# EAGLE design CON_REVC (EAGLE 9.6.2)

## Sheet 1 of 2: Template
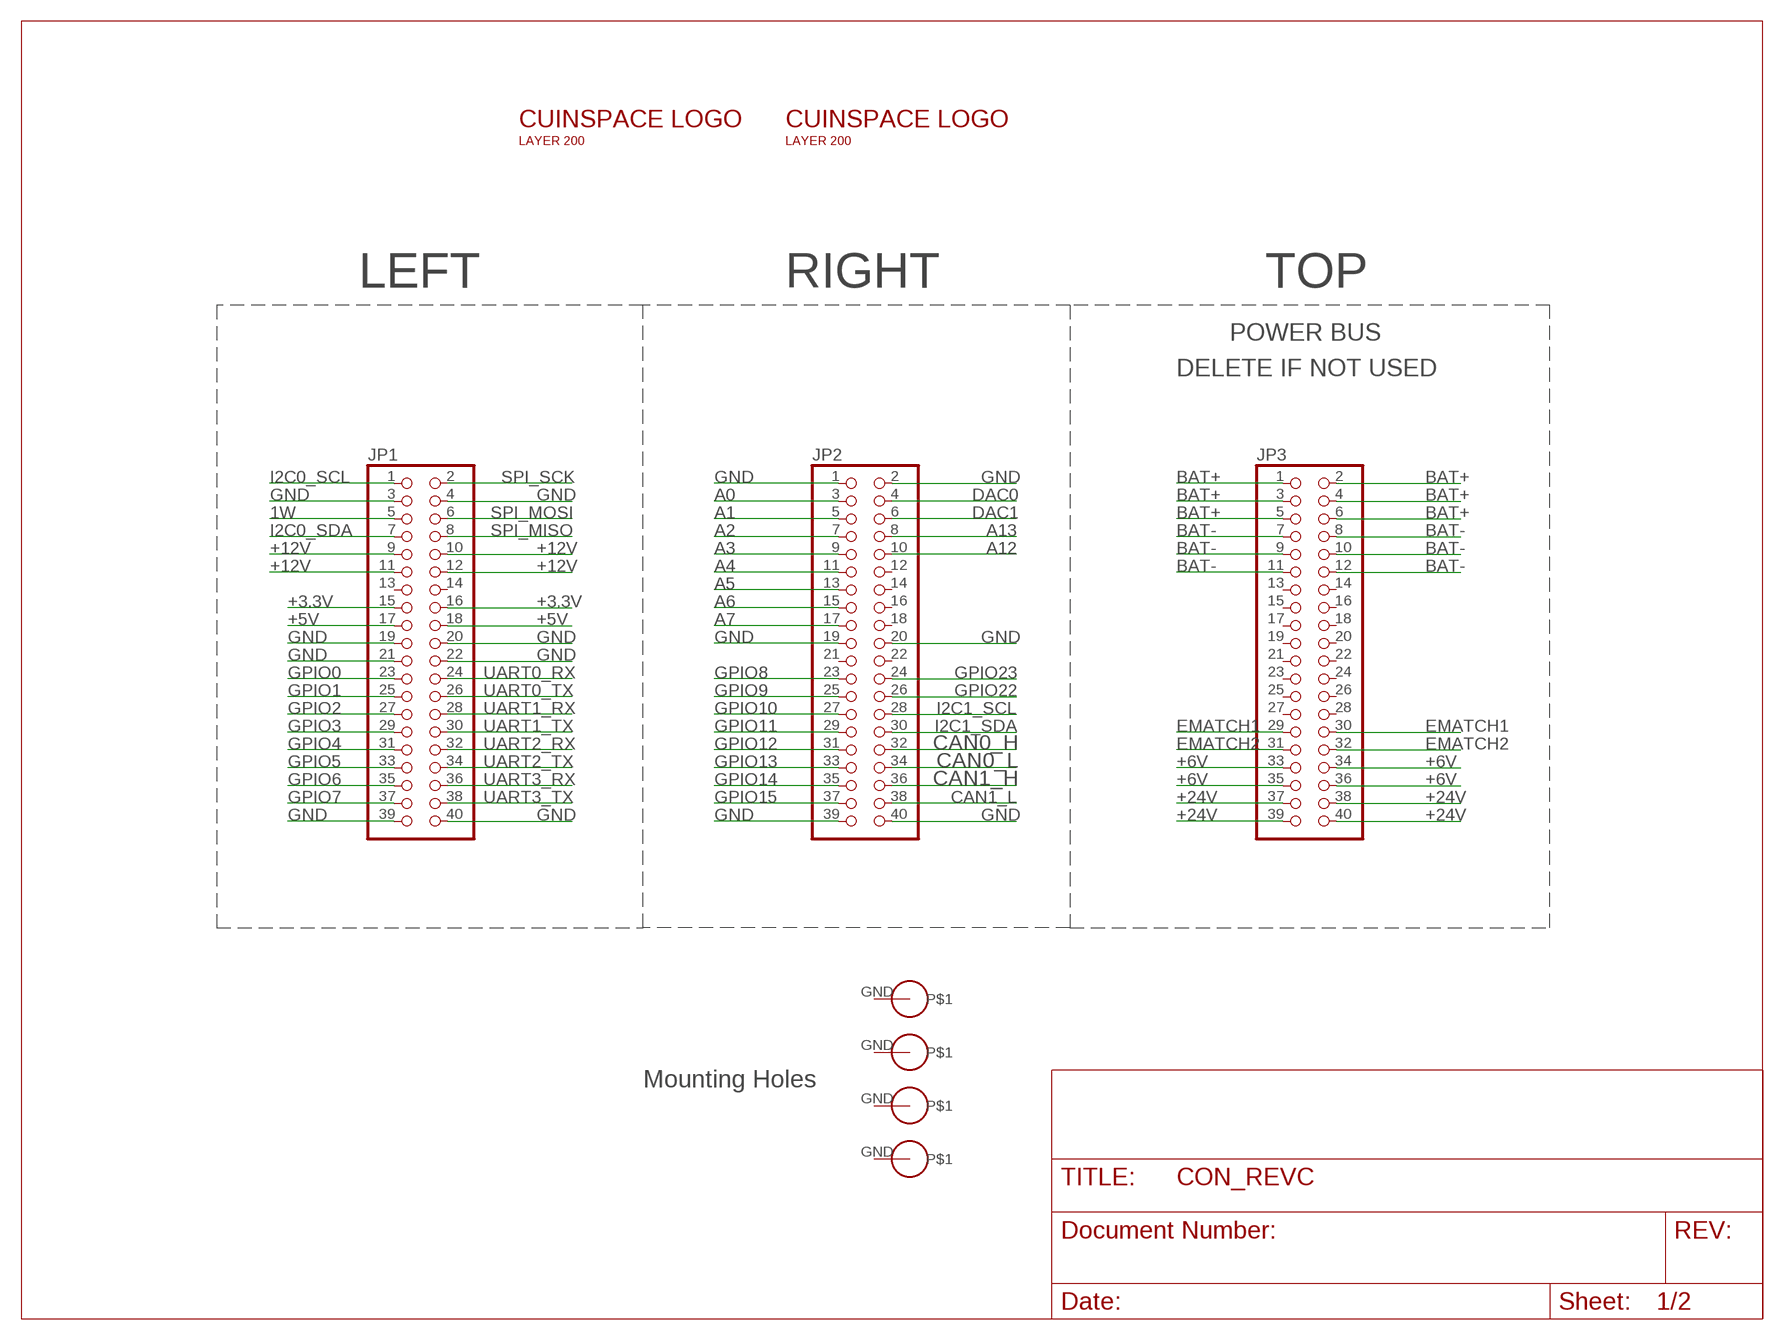
[diagram p0: schematic, sheet 1]

### Parts
$$U$1  PS/104-MOUNTING-HOLE  [PC/104-MOUNTING-HOLE]
JP1  PINHD-2X20  [2X20]
JP2  PINHD-2X20  [2X20]
JP3  PINHD-2X20  [2X20]
U$1  PS/104-MOUNTING-HOLE  [PC/104-MOUNTING-HOLE]
U$2  PS/104-MOUNTING-HOLE  [PC/104-MOUNTING-HOLE]
U$3  PS/104-MOUNTING-HOLE  [PC/104-MOUNTING-HOLE]
U$5  INSPACE3CM_L  [INSPACE_3CM_LETTERS]
U$6  INSPACE3CM_L  [INSPACE_3CM_LETTERS]

### Nets
1W: JP1.5
+3.3V: JP1.15 JP1.16
+5V: JP1.17 JP1.18 ; also sheet 2
+6V: JP3.33 JP3.34 JP3.35 JP3.36
+12V: JP1.9 JP1.10 JP1.11 JP1.12
+24V: JP3.37 JP3.38 JP3.39 JP3.40
A0: JP2.3
A1: JP2.5
A2: JP2.7
A3: JP2.9
A4: JP2.11
A5: JP2.13
A6: JP2.15
A7: JP2.17
A12: JP2.10
A13: JP2.8
BAT+: JP3.1 JP3.2 JP3.3 JP3.4 JP3.5 JP3.6 ; also sheet 2
BAT-: JP3.7 JP3.8 JP3.9 JP3.10 JP3.11 JP3.12 ; also sheet 2
CAN0_H [diff pairs]: JP2.32
CAN0_L [diff pairs]: JP2.34
CAN1_H: JP2.36
CAN1_L: JP2.38
DAC0: JP2.4
DAC1: JP2.6
EMATCH1: JP3.29 JP3.30 ; also sheet 2
EMATCH2: JP3.31 JP3.32 ; also sheet 2
GND [New Class]: JP1.3 JP1.4 JP1.19 JP1.20 JP1.21 JP1.22 JP1.39 JP1.40 JP2.1 JP2.2 JP2.19 JP2.20 JP2.39 JP2.40 ; also sheet 2
GPIO0: JP1.23
GPIO1: JP1.25
GPIO2: JP1.27
GPIO3: JP1.29
GPIO4: JP1.31
GPIO5: JP1.33
GPIO6: JP1.35
GPIO7: JP1.37
GPIO8: JP2.23
GPIO9: JP2.25
GPIO10: JP2.27
GPIO11: JP2.29
GPIO12: JP2.31
GPIO13: JP2.33
GPIO14: JP2.35
GPIO15: JP2.37 ; also sheet 2
GPIO22: JP2.26
GPIO23: JP2.24
I2C0_SCL: JP1.1
I2C0_SDA: JP1.7
I2C1_SCL: JP2.28
I2C1_SDA: JP2.30
SPI_MISO: JP1.8
SPI_MOSI: JP1.6
SPI_SCK: JP1.2
UART0_RX: JP1.24
UART0_TX: JP1.26
UART1_RX: JP1.28
UART1_TX: JP1.30
UART2_RX: JP1.32
UART2_TX: JP1.34
UART3_RX: JP1.36
UART3_TX: JP1.38
Unconnected: $$U$1.GND JP1.13 JP1.14 JP2.12 JP2.14 JP2.16 JP2.18 JP2.21 JP2.22 JP3.13 JP3.14 JP3.15 JP3.16 JP3.17 JP3.18 JP3.19 JP3.20 JP3.21 JP3.22 JP3.23 JP3.24 JP3.25 JP3.26 JP3.27 JP3.28 U$1.GND U$2.GND U$3.GND

### Notes on the sheet
- LEFT | RIGHT | TOP
- POWER BUS
- DELETE IF NOT USED
- Mounting Holes

## Sheet 2 of 2
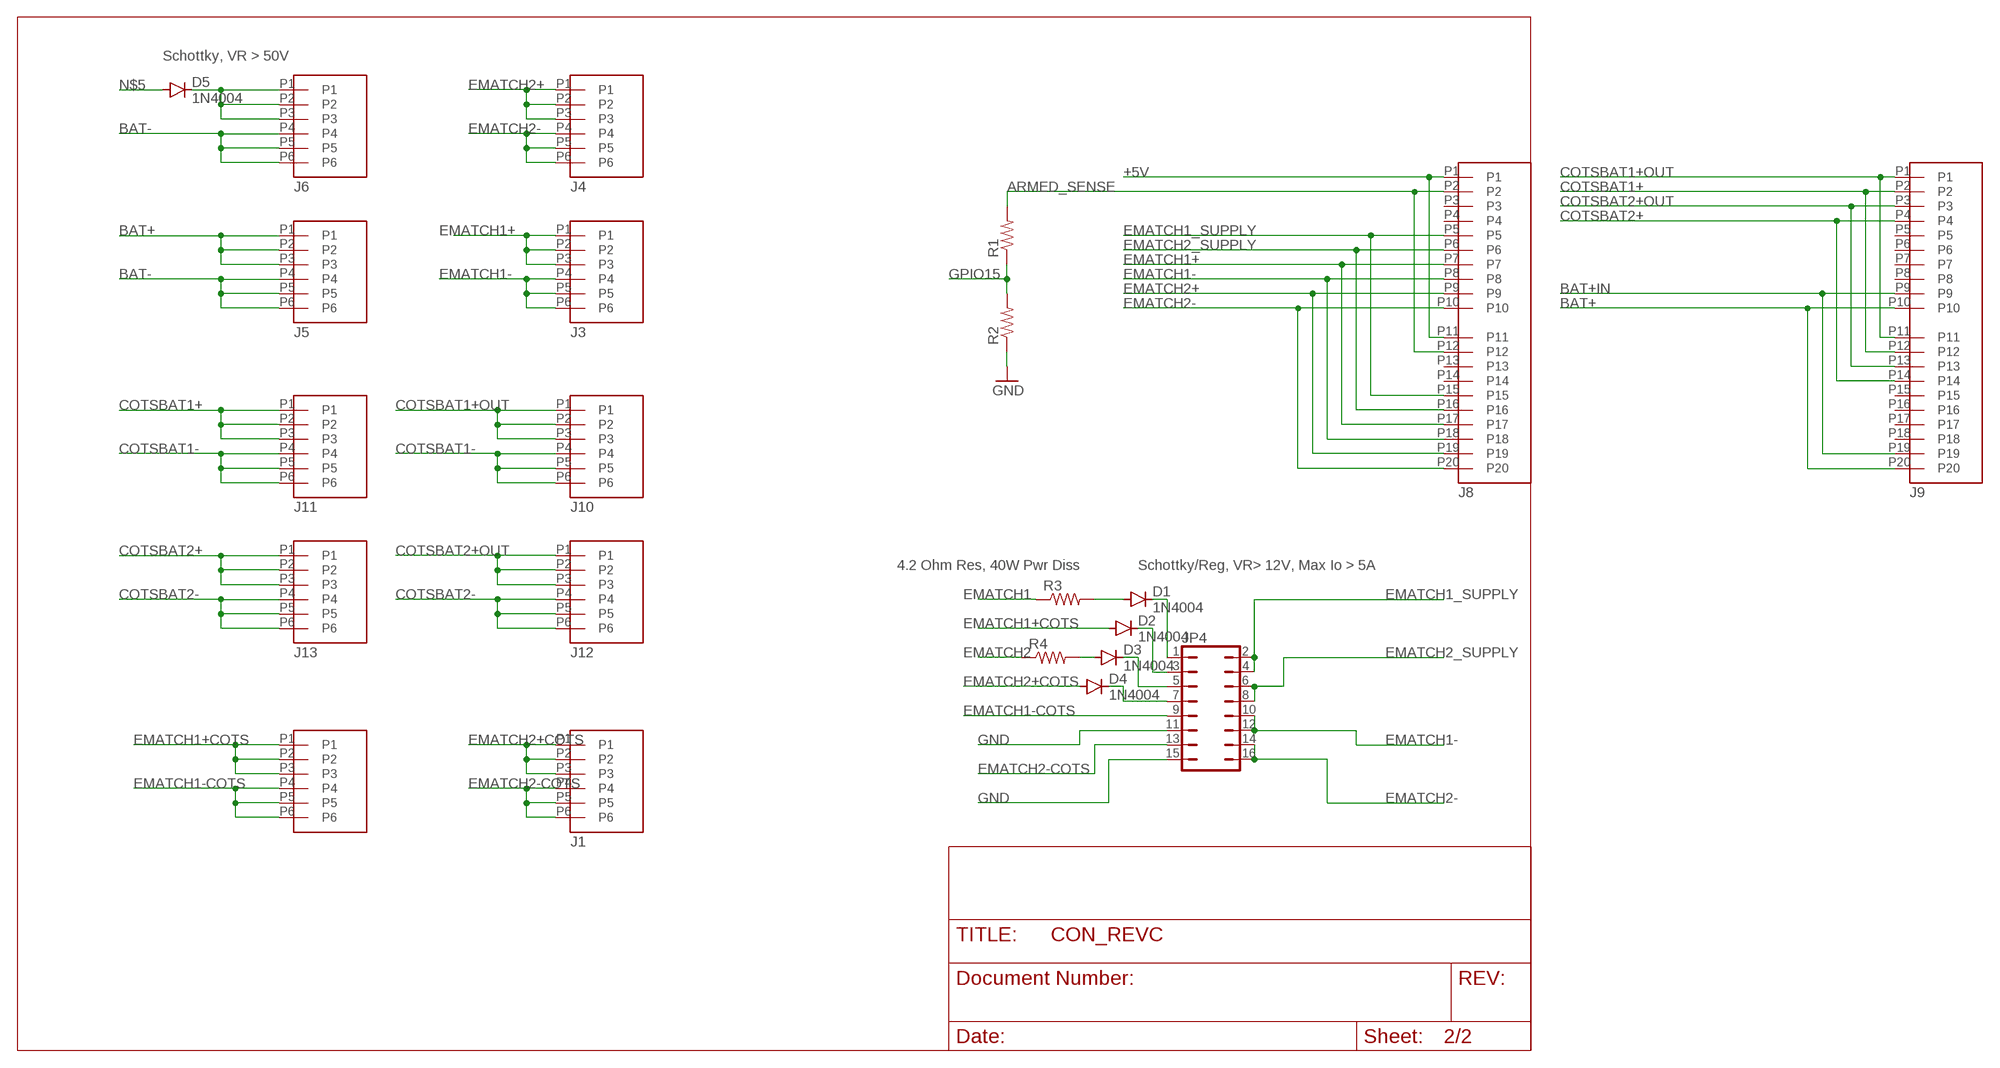
[diagram p1: schematic, sheet 2]

### Parts
D1  1N4004  [DO41-10]
D2  1N4004  [DO41-10]
D3  1N4004  [DO41-10]
D4  1N4004  [DO41-10]
D5  1N4004  [DO41-10]
J1  M80-5100642  [M80-5100642]
J2  M80-5100642  [M80-5100642]
J3  M80-5100642  [M80-5100642]
J4  M80-5100642  [M80-5100642]
J5  M80-5100642  [M80-5100642]
J6  M80-5100642  [M80-5100642]
J8  M80-5102042  [M80-5102042]
J9  M80-5102042  [M80-5102042]
J10  M80-5100642  [M80-5100642]
J11  M80-5100642  [M80-5100642]
J12  M80-5100642  [M80-5100642]
J13  M80-5100642  [M80-5100642]
JP4  JP8Q  [JP8Q]
R1  R-US_R0805  [R0805]
R2  R-US_R0805  [R0805]
R3  R-US_R0805  [R0805]
R4  R-US_R0805  [R0805]

### Nets
+5V: J8.P1 J8.P11 ; also sheet 1
ARMED_SENSE: J8.P2 J8.P12 R1.2
BAT+: J5.P1 J5.P2 J5.P3 J9.P10 J9.P20 ; also sheet 1
BAT+IN: D5.C J6.P1 J6.P2 J6.P3 J9.P9 J9.P19
BAT-: J5.P4 J5.P5 J5.P6 J6.P4 J6.P5 J6.P6 ; also sheet 1
COTSBAT1+: J9.P2 J9.P12 J11.P1 J11.P2 J11.P3
COTSBAT1+OUT: J9.P1 J9.P11 J10.P1 J10.P2 J10.P3
COTSBAT1-: J10.P4 J10.P5 J10.P6 J11.P4 J11.P5 J11.P6
COTSBAT2+: J9.P4 J9.P14 J13.P1 J13.P2 J13.P3
COTSBAT2+OUT: J9.P3 J9.P13 J12.P1 J12.P2 J12.P3
COTSBAT2-: J12.P4 J12.P5 J12.P6 J13.P4 J13.P5 J13.P6
EMATCH1: R3.1 ; also sheet 1
EMATCH1+: J3.P1 J3.P2 J3.P3 J8.P7 J8.P17
EMATCH1+COTS: D2.A J2.P1 J2.P2 J2.P3
EMATCH1-: J3.P4 J3.P5 J3.P6 J8.P8 J8.P18 JP4.10 JP4.12
EMATCH1-COTS: J2.P4 J2.P5 J2.P6 JP4.9
EMATCH1_SUPPLY: J8.P5 J8.P15 JP4.2 JP4.4
EMATCH2: R4.1 ; also sheet 1
EMATCH2+: J4.P1 J4.P2 J4.P3 J8.P9 J8.P19
EMATCH2+COTS: D4.A J1.P1 J1.P2 J1.P3
EMATCH2-: J4.P4 J4.P5 J4.P6 J8.P10 J8.P20 JP4.14 JP4.16
EMATCH2-COTS: J1.P4 J1.P5 J1.P6 JP4.13
EMATCH2_SUPPLY: J8.P6 J8.P16 JP4.6 JP4.8
GND [New Class]: JP4.11 JP4.15 R2.1 ; also sheet 1
GPIO15: R1.1 R2.2 ; also sheet 1
N$1: D1.C JP4.1
N$2: D2.C JP4.3
N$3: D3.C JP4.5
N$4: D4.C JP4.7
N$5: D5.A
N$6: D1.A R3.2
N$7: D3.A R4.2
Unconnected: J8.P3 J8.P4 J8.P13 J8.P14 J9.P5 J9.P6 J9.P7 J9.P8 J9.P15 J9.P16 J9.P17 J9.P18

### Notes on the sheet
- Schottky, VR > 50V
- 4.2 Ohm Res, 40W Pwr Diss | Schottky/Reg, VR> 12V, Max Io > 5A

## Library data of the parts
$$U$1 U$1-U$3 = CU inSpace 2019 Parts:PS/104-MOUNTING-HOLE: Mounting hole for PC/104 board.
D1-D5 = diode:1N4004: DIODE general purpose rectifier, 1 A
J1-J6 J10-J13 = connectors:M80-5100642
J8 J9 = connectors:M80-5102042
JP1-JP3 = pinhead:PINHD-2X20: PIN HEADER
JP4 = jumper:JP8Q: JUMPER
R1-R4 = rcl:R-US_: RESISTOR, American symbol; SPICEPREFIX: R
U$5 U$6 = Logos:INSPACE

## Net classes
2 diff pairs: width 0.254 mm

## Board
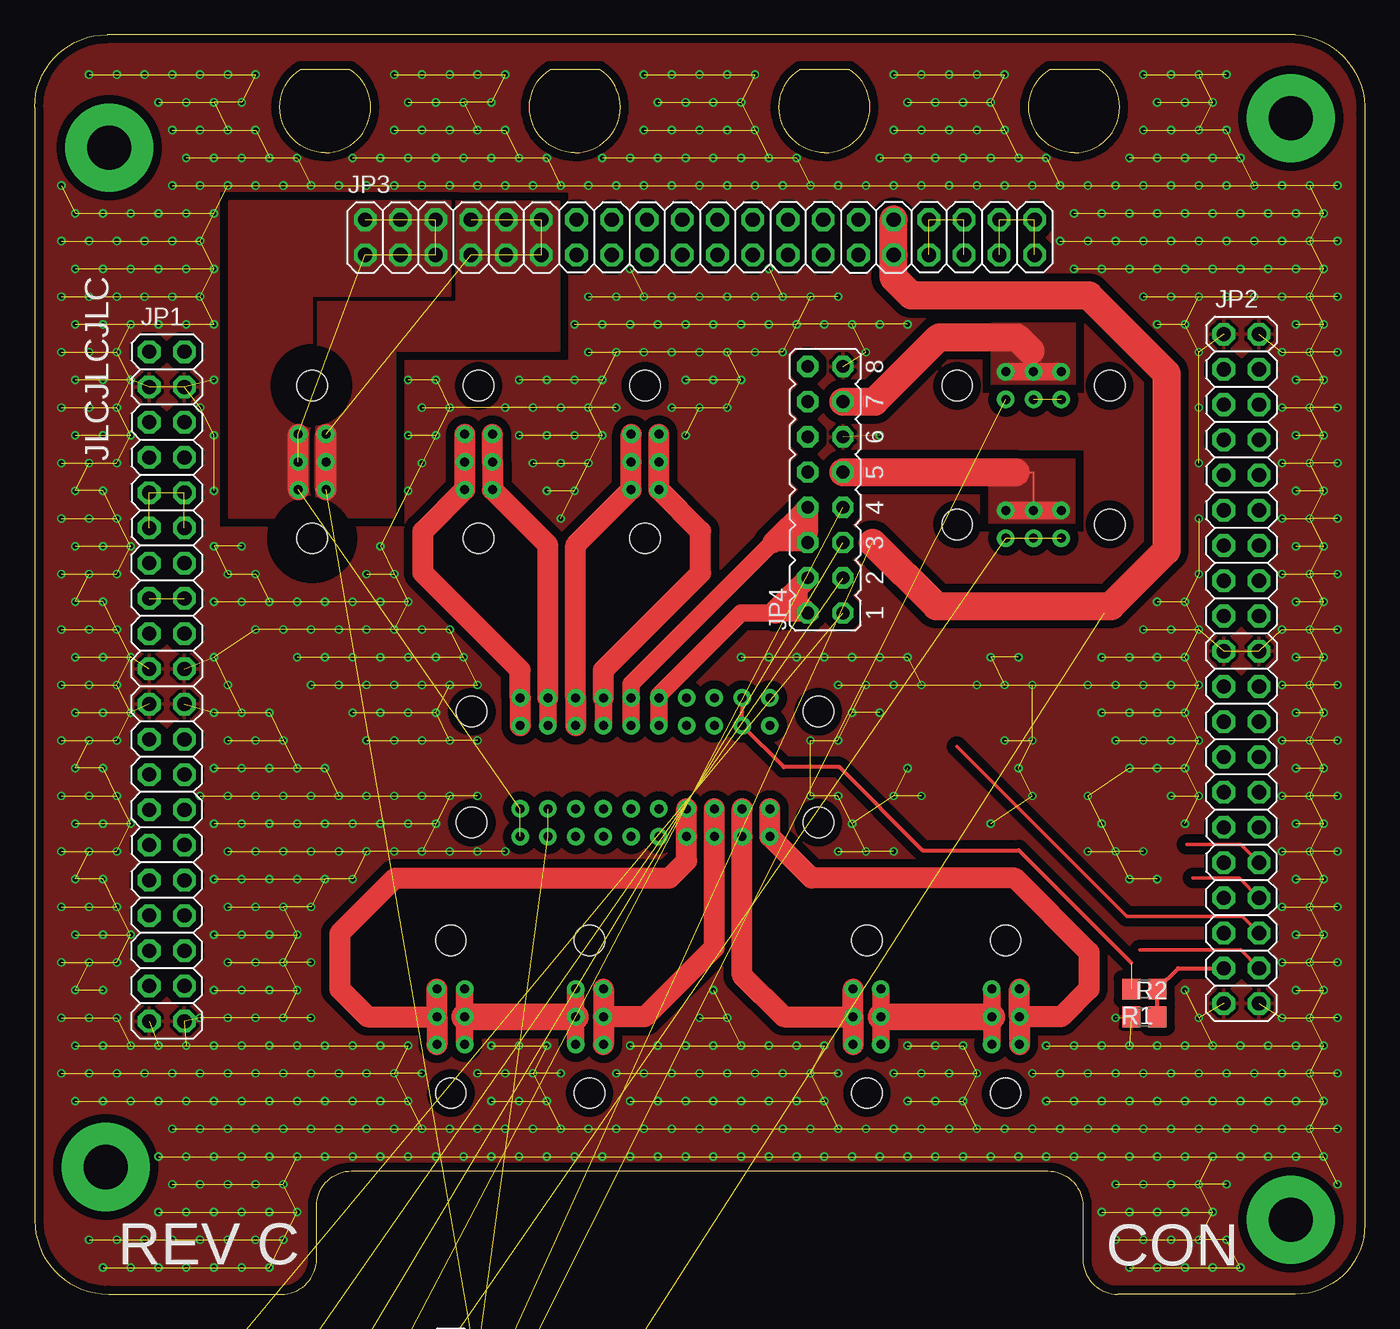
[diagram p2: board, top side]
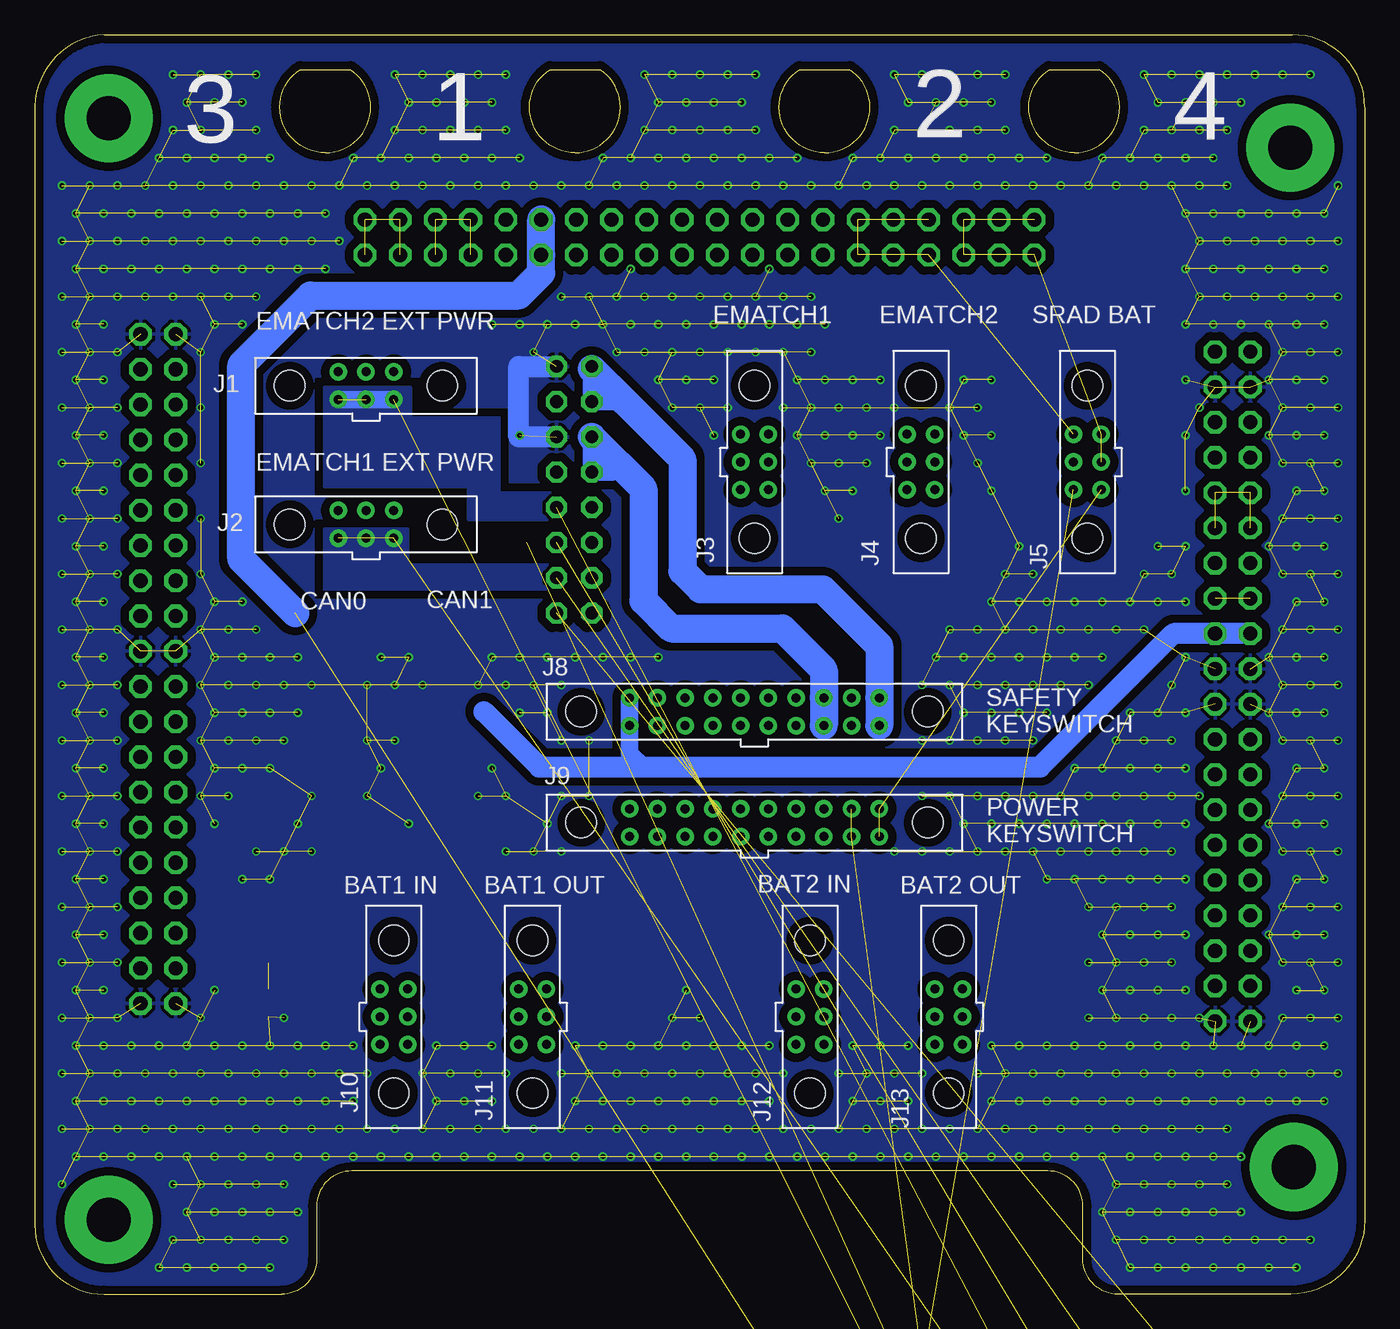
[diagram p3: board, bottom side, seen from below]

Size 95.89 x 90.81 mm. Coordinates in mm from the lower left corner, seen from the top.
Outline: 0,5.33 0,85.57 arc-90 5.23,90.81 90.89,90.81 arc-90 95.89,85.17 95.89,5
Outline: 0,5.33 arc90 5.33,0
Outline: 95.89,5 arc-90 90.89,0
Outline: 0,5.33 arc90 5.33,0
Outline: 5.33,0 17.78,0 arc90 20.32,2.54 20.32,6.35 arc-90 22.86,8.89 73.03,8.89 arc-90 75.56,6.35 75.56,2.54 arc90 78.11,0 90.89,0
Outline: 95.89,5 arc-90 90.89,0
Outline: 20.95,82.3 arc-147 19.15,88.3 22.75,88.3 arc-147 20.95,82.3
Outline: 38.95,82.3 arc-147 37.15,88.3 40.75,88.3 arc-147 38.95,82.3
Outline: 56.95,82.3 arc-147 55.15,88.3 58.75,88.3 arc-147 56.95,82.3
Outline: 74.95,82.3 arc-147 73.15,88.3 76.75,88.3 arc-147 74.95,82.3
Copper layers (1*16): Top 0.035mm / dielectric 1.53mm / Bottom 0.035mm
Design rules "JLC 2 Layer *": minimum track width 5mil, minimum drill 0.2mm, track to track 3.5mil, track to pad 3.5mil, pad to pad 5mil, via to via 10mil, smd to smd 0mil, copper to edge 10mil, drill to drill 10mil, minimum pad ring 12mil, minimum via ring 5mil, stop-mask expansion 4mil, vias tented up to drill 0.4mm, thermal gap 10mil
tRestrict: area 17.5,63 to 22.5,68; area 17.5,52 to 22.5,57

### Footprints (pad centres in the part's own frame; a part is rotated, then mirrored left to right if it is on the bottom)
PC/104-MOUNTING-HOLE = drill 3.175 pad 6.35: GND 0,0
DO41-10 = drill 1.118: A 5.08,0; C -5.08,0
M80-5100642 = drill 0.65: P1 2,1; P2 0,1; P3 -2,1; P4 2,-1; P5 0,-1; P6 -2,-1 | hole 2.2: -5.5,0; 5.5,0
M80-5102042 = drill 0.65: P1 9,1; P2 7,1; P3 5,1; P4 3,1; P5 1,1; P6 -1,1; P7 -3,1; P8 -5,1; P9 -7,1; P10 -9,1; P11 9,-1; P12 7,-1; P13 5,-1; P14 3,-1; P15 1,-1; P16 -1,-1; P17 -3,-1; P18 -5,-1; P19 -7,-1; P20 -9,-1 | hole 2.2: -12.5,0; 12.5,0
2X20 = drill 1.016 octagon: 1 -24.13,-1.27; 2 -24.13,1.27; 3 -21.59,-1.27; 4 -21.59,1.27; 5 -19.05,-1.27; 6 -19.05,1.27; 7 -16.51,-1.27; 8 -16.51,1.27; 9 -13.97,-1.27; 10 -13.97,1.27; 11 -11.43,-1.27; 12 -11.43,1.27; 13 -8.89,-1.27; 14 -8.89,1.27; 15 -6.35,-1.27; 16 -6.35,1.27; 17 -3.81,-1.27; 18 -3.81,1.27; 19 -1.27,-1.27; 20 -1.27,1.27; 21 1.27,-1.27; 22 1.27,1.27; 23 3.81,-1.27; 24 3.81,1.27; 25 6.35,-1.27; 26 6.35,1.27; 27 8.89,-1.27; 28 8.89,1.27; 29 11.43,-1.27; 30 11.43,1.27; 31 13.97,-1.27; 32 13.97,1.27; 33 16.51,-1.27; 34 16.51,1.27; 35 19.05,-1.27; 36 19.05,1.27; 37 21.59,-1.27; 38 21.59,1.27; 39 24.13,-1.27; 40 24.13,1.27
JP8Q = drill 0.914 octagon: 1 -8.89,-1.27; 2 -8.89,1.27; 3 -6.35,-1.27; 4 -6.35,1.27; 5 -3.81,-1.27; 6 -3.81,1.27; 7 -1.27,-1.27; 8 -1.27,1.27; 9 1.27,-1.27; 10 1.27,1.27; 11 3.81,-1.27; 12 3.81,1.27; 13 6.35,-1.27; 14 6.35,1.27; 15 8.89,-1.27; 16 8.89,1.27
R0805 = smd 1.3 x 1.5: 1 -0.95,0; 2 0.95,0

### Placement (x,y rotation side)
$$U$1  5.13,9.17 0 top
D1  10,-15 0 top  (outside the outline)
D2  10,-25 0 top  (outside the outline)
D3  10,-35 0 top  (outside the outline)
D4  10,-45 0 top  (outside the outline)
D5  10,-55 0 top  (outside the outline)
J1  72,65.5 180 bottom
J2  72,55.5 180 bottom
J3  44,60 90 bottom
J4  32,60 90 bottom
J5  20,60 270 bottom
J6  30,-5 0 top  (outside the outline)
J8  44,42 180 bottom
J9  44,34 180 bottom
J10  70,20 90 bottom
J11  60,20 270 bottom
J12  40,20 90 bottom
J13  30,20 270 bottom
JP1  9.53,43.81 270 top
JP2  87,45.09 270 top
JP3  47.96,76.2 0 top
JP4  57,58 90 top
R1  80,22 180 top
R2  80,20 0 top
R3  5,-65 0 top  (outside the outline)
R4  5,-70 0 top  (outside the outline)
U$1  90.55,84.79 0 top
U$2  5.36,82.65 0 top
U$3  90.55,5.36 0 top
U$5  5.68,61.35 270 bottom
U$6  90.72,30.1 90 bottom

### Tracks (layer width: path | path; a pad name or v marks a point on that pad's centre or on a via)
+3.3V  (1 unrouted)
+5V
  Bottom 1.27: J8.P11 J8.P1 53,39 52,38
  Bottom 1.5: JP1.17 JP1.18 13.79,47.62 23.42,38 52,38 59.51,38 63.51,42
+6V  (3 unrouted)
+12V  (3 unrouted)
+24V  (3 unrouted)
ARMED_SENSE  (1 unrouted)
  Top 0.254: J8.P12 51,42
  Top 0.305: 51,42 J8.P2 54,38 58,38 64,32 70.95,32 79.05,23.9
BAT+  (9 unrouted)
  Top 1.524: J5.P1 J5.P3
  pour Top (isolate 0.406, no thermals): 30,78.8 14,78.8 14,56 20,56 20,72 30,72
BAT+IN  (5 unrouted)
BAT-  (9 unrouted)
  Top 1.524: J5.P4 J5.P5 J5.P6
  pour Top (isolate 0.305, rank 2, no thermals): 37.8,78.8 37.8,68 26,68 26,56 20,56 20,72 30,72 30,78.8
CAN0_H
  Top 0.256: JP2.32 86.94,32.44 83.06,32.44
CAN0_L
  Top 0.256: JP2.34 86.84,30 83.5,30
CAN1_H
  Top 0.256: JP2.36 87.05,27.25 78.75,27.25 66.5,39.5
CAN1_L
  Top 0.256: JP2.38 86.94,24.82 79.68,24.82
COTSBAT1+
  Top 1.5: J11.P2 54,20 51,23 J9.P2 J9.P12 | J11.P2 J11.P3 | J11.P2 J11.P1
COTSBAT1+OUT
  Top 1.5: J10.P2 74,20 76,22 76,24.65 70.65,30 56,30 J9.P1 J9.P11 | J10.P2 J10.P1 | J10.P2 J10.P3
COTSBAT1-
  Top 1.27: J11.P6 J11.P5 J11.P4 | J10.P5 J10.P4 J10.P6
  Top 1.905: J11.P5 J10.P5
COTSBAT2+
  Top 1.5: J13.P2 24,20 22,22 22,26 26,30 45.75,30 47,31.25 J9.P4 J9.P14 | J13.P2 J13.P3 | J13.P2 J13.P1
COTSBAT2+OUT
  Top 1.5: J12.P1 J12.P2 | J12.P2 J12.P3 | J12.P2 44,20 49,25 J9.P3 J9.P13
COTSBAT2-
  Top 1.27: J13.P6 J13.P5 J13.P4 | J12.P4 J12.P5 J12.P6
  Top 1.905: J13.P5 J12.P5
EMATCH1  (1 unrouted)
  Bottom 2: JP3.30 JP3.29 59.38,73.61 61,72 76,72 81,67 81,53 77.11,49.11
EMATCH1+
  Top 1.27: J8.P17 J8.P7
  Top 1.524: J8.P17 41,45 48,52 48,55 J3.P3 J3.P2 J3.P1
EMATCH1+COTS  (3 unrouted)
  pour Bottom (isolate 0.254, no thermals): 57.4,52.6 57.4,50.8 75,50.8 75,54.4 75,55.2 69,55.2 69,53.6 69,52.6
EMATCH1-
  Top 1.524: J3.P4 J3.P5 J3.P6 39,54 J8.P18 J8.P8
  Bottom 1.27: 54.27,59.27 JP4.10 JP4.12 55.73,60.73
  Bottom 2: JP4.12 52,58.08 52,50 50,48 42,48 39,45 J8.P18 J8.P8
EMATCH1-COTS
  Top 0.127: 70.73,59.27 72,59.27 J2.P5
  Top 1.27: J2.P6 J2.P5 J2.P4
  Top 2: JP4.9 70.73,59.27
  pour Top (isolate 0.254, no thermals): 75,55.6 68.8,55.6 68.8,60.2 75,60.2
EMATCH1_SUPPLY
  Top 1.27: JP4.2 53.4,49.11 50.92,49.11 45,43.19 J8.P15 J8.P5
  Top 1.5: 53.4,49.11 53.4,49.32 JP4.4 55,50.92 55,49.8 55.04,49.8 JP4.2
EMATCH2  (1 unrouted)
  Top 2: 60.41,54.19 65,49.6 77.6,49.6 81.6,53.6 81.6,66.4 76,72 63.2,72 61.92,73.28 JP3.31 JP3.32
EMATCH2+
  Top 1.27: J8.P19 J8.P9
  Top 1.524: J4.P1 J4.P2 J4.P3 37,54 J8.P19
EMATCH2+COTS  (2 unrouted)
  Bottom 1.27: J1.P1 J1.P3
  pour Bottom (isolate 0.254, no thermals): 57.4,57.8 57.4,55.8 64.6,55.8 64.6,58.2 75,58.2 75,65.4 68.8,65.4 68.8,63.2 62.4,63.2 62.4,57.8
EMATCH2-
  Top 1.524: J4.P4 J4.P5 J4.P6 28,55 28,52 35,45 J8.P20 J8.P10
  Bottom 1.27: 53.35,64.35 JP4.14 JP4.16 55.73,66.73
  Bottom 2: 55.73,66.73 53.35,64.35 49.2,60.2 49.2,52.12 47.9,50.83 39.09,50.83 35,46.73 J8.P20 J8.P10
EMATCH2-COTS
  Top 0.203: 71.8,68 72,67.8 J1.P5
  Top 1.27: J1.P4 J1.P5 J1.P6
  Top 2: JP4.13 60.55,64.35 65.2,69 70.8,69 71.8,68
  pour Top (isolate 0.254, no thermals): 75,65.6 69,65.6 69,70 75,70
EMATCH2_SUPPLY
  Top 1.27: JP4.6 53.19,54.19 43,44 J8.P16 J8.P6
  Top 1.5: 53.19,54.19 JP4.8 55.73,55 55.2,55 55,54.8 55.12,54.8 JP4.6
GND  (via drill 0.35)  (888 unrouted)
  Bottom 1.5: JP4.11 60.19,61.81 60.2,61.8 61,61.8 61,66.89 JP4.15
  other vias: 2.92,13.92 1.92,15.92 2.92,17.92 1.92,19.92 2.92,21.92 1.92,23.92 2.92,25.92 1.92,27.92 2.92,29.92 1.92,31.92 2.92,33.92 1.92,35.92 2.92,37.92 1.92,39.92 2.92,41.92 1.92,43.92 2.92,45.92 1.92,47.92 2.92,49.92 1.92,51.92 2.92,53.92 1.92,55.92 2.92,57.92 1.92,59.92 2.92,61.92 1.92,63.92 2.92,65.92 1.92,67.92 2.92,69.92 1.92,71.92 2.92,73.92 1.92,75.92 2.92,77.92 1.92,79.92 4.92,1.92 3.92,3.92 4.92,13.92 3.92,15.92 4.92,17.92 3.92,19.92 4.92,21.92 3.92,23.92 4.92,25.92 3.92,27.92 4.92,29.92 3.92,31.92 4.92,33.92 3.92,35.92 4.92,37.92 3.92,39.92 4.92,41.92 3.92,43.92 4.92,45.92 3.92,47.92 4.92,49.92 3.92,51.92 4.92,53.92 3.92,55.92 4.92,57.92 3.92,59.92 4.92,61.92 3.92,63.92 4.92,65.92 3.92,67.92 4.92,69.92 3.92,71.92 4.92,73.92 3.92,75.92 4.92,77.92 3.92,87.92 6.92,1.92 5.92,3.92 6.92,13.92 5.92,15.92 6.92,17.92 5.92,19.92 5.92,23.92 6.92,25.92 5.92,27.92 5.92,31.92 6.92,33.92 5.92,35.92 5.92,39.92 6.92,41.92 5.92,43.92 6.92,45.92 5.92,47.92 5.92,51.92 6.92,53.92 5.92,55.92 5.92,59.92 6.92,61.92 5.92,63.92 6.92,65.92 5.92,67.92 6.92,69.92 5.92,71.92 6.92,73.92 5.92,75.92 6.92,77.92 5.92,87.92 8.92,1.92 7.92,3.92 8.92,5.92 8.92,9.92 8.92,13.92 7.92,15.92 8.92,17.92 8.92,69.92 7.92,71.92 8.92,73.92 7.92,75.92 8.92,77.92 8.92,85.92 7.92,87.92 10.92,1.92 9.92,3.92 10.92,5.92 9.92,7.92 10.92,9.92 9.92,11.92 10.92,13.92 9.92,15.92 10.92,17.92 10.92,69.92 9.92,71.92 10.92,73.92 9.92,75.92 10.92,77.92 9.92,79.92 10.92,81.92 9.92,83.92 10.92,85.92 9.92,87.92 12.92,1.92 11.92,3.92 12.92,5.92 11.92,7.92 12.92,9.92 11.92,11.92 12.92,13.92 11.92,15.92 12.92,17.92 11.92,19.92 12.92,21.92 12.92,25.92 12.92,29.92 12.92,33.92 11.92,35.92 12.92,37.92 12.92,41.92 12.92,45.92 12.92,49.92 12.92,53.92 12.92,57.92 12.92,61.92 11.92,63.92 12.92,65.92 12.92,69.92 11.92,71.92 12.92,73.92 11.92,75.92 12.92,77.92 11.92,79.92 12.92,81.92 11.92,83.92 12.92,85.92 11.92,87.92 14.92,1.92 13.92,3.92 14.92,5.92 13.92,7.92 14.92,9.92 13.92,11.92 14.92,13.92 13.92,15.92 14.92,17.92 13.92,19.92 14.92,21.92 13.92,23.92 14.92,25.92 13.92,27.92 14.92,29.92 13.92,31.92 14.92,33.92 13.92,35.92 14.92,37.92 13.92,39.92 14.92,41.92 13.92,43.92 14.92,49.92 13.92,51.92 14.92,53.92 13.92,79.92 14.92,81.92 13.92,83.92 14.92,85.92 13.92,87.92 16.92,1.92 15.92,3.92 16.92,5.92 15.92,7.92 16.92,9.92 15.92,11.92 16.92,13.92 15.92,15.92 16.92,17.92 15.92,19.92 16.92,21.92 15.92,23.92 16.92,25.92 15.92,27.92 16.92,29.92 15.92,31.92 16.92,33.92 15.92,35.92 16.92,37.92 15.92,39.92 16.92,41.92 15.92,47.92 16.92,49.92 15.92,51.92 15.92,79.92 16.92,81.92 15.92,83.92 15.92,87.92 17.92,3.92 18.92,5.92 17.92,7.92 18.92,9.92 17.92,11.92 18.92,13.92 17.92,15.92 18.92,17.92 17.92,19.92 18.92,21.92 17.92,23.92 18.92,25.92 17.92,27.92 18.92,29.92 17.92,31.92 18.92,33.92 17.92,35.92 18.92,37.92 17.92,39.92 18.92,45.92 17.92,47.92 18.92,49.92 17.92,79.92 18.92,81.92 20.92,9.92 19.92,11.92 20.92,13.92 19.92,15.92 20.92,17.92 19.92,19.92 19.92,23.92 19.92,27.92 20.92,29.92 19.92,31.92 20.92,33.92 19.92,35.92 20.92,37.92 19.92,43.92 20.92,45.92 19.92,47.92 20.92,49.92 19.92,79.92 22.92,9.92 21.92,11.92 22.92,13.92 21.92,15.92 22.92,17.92 22.92,29.92 21.92,31.92 22.92,33.92 21.92,35.92 22.92,41.92 21.92,43.92 22.92,45.92 21.92,47.92 22.92,49.92 21.92,79.92 22.92,81.92 24.92,9.92 23.92,11.92 24.92,13.92 23.92,15.92 24.92,17.92 23.92,31.92 24.92,33.92 23.92,35.92 23.92,39.92 24.92,41.92 23.92,43.92 24.92,45.92 23.92,47.92 24.92,49.92 23.92,51.92 24.92,53.92 23.92,79.92 24.92,81.92 26.92,9.92 25.92,11.92 26.92,13.92 25.92,15.92 26.92,17.92 25.92,31.92 26.92,33.92 25.92,35.92 25.92,39.92 26.92,41.92 25.92,43.92 26.92,45.92 25.92,47.92 26.92,49.92 25.92,51.92 26.92,57.92 26.92,61.92 26.92,65.92 25.92,79.92 26.92,81.92 25.92,83.92 26.92,85.92 25.92,87.92 28.92,9.92 27.92,11.92 27.92,15.92 27.92,31.92 28.92,33.92 27.92,35.92 27.92,39.92 28.92,41.92 27.92,43.92 28.92,45.92 27.92,47.92 27.92,59.92 28.92,61.92 27.92,63.92 28.92,65.92 27.92,79.92 28.92,81.92 27.92,83.92 28.92,85.92 27.92,87.92 30.92,9.92 29.92,11.92 29.92,31.92 29.92,35.92 29.92,39.92 29.92,43.92 30.92,45.92 29.92,47.92 29.92,63.92 29.92,79.92 30.92,81.92 29.92,83.92 30.92,85.92 29.92,87.92 32.92,9.92 31.92,11.92 32.92,13.92 31.92,15.92 32.92,17.92 31.92,31.92 31.92,35.92 31.92,39.92 31.92,43.92 31.92,79.92 32.92,81.92 31.92,83.92 32.92,85.92 31.92,87.92 34.92,9.92 33.92,11.92 34.92,13.92 33.92,15.92 34.92,17.92 33.92,31.92 34.92,61.92 33.92,63.92 34.92,65.92 33.92,79.92 34.92,81.92 33.92,83.92 33.92,87.92 36.92,9.92 35.92,11.92 36.92,13.92 35.92,15.92 36.92,17.92 36.92,57.92 35.92,59.92 36.92,61.92 35.92,63.92 36.92,65.92 35.92,79.92 36.92,81.92 38.92,9.92 37.92,11.92 37.92,15.92 37.92,55.92 38.92,57.92 37.92,59.92 38.92,61.92 37.92,63.92 38.92,65.92 38.92,69.92 37.92,79.92 40.92,9.92 39.92,11.92 39.92,59.92 40.92,61.92 39.92,63.92 40.92,65.92 39.92,67.92 40.92,69.92 39.92,71.92 39.92,79.92 40.92,81.92 42.92,9.92 41.92,11.92 42.92,13.92 41.92,15.92 42.92,17.92 41.92,63.92 41.92,67.92 42.92,69.92 41.92,71.92 42.92,73.92 41.92,79.92 42.92,81.92 44.92,9.92 43.92,11.92 44.92,13.92 43.92,15.92 44.92,17.92 43.92,67.92 44.92,69.92 43.92,71.92 43.92,79.92 44.92,81.92 43.92,83.92 44.92,85.92 43.92,87.92 46.92,9.92 45.92,11.92 46.92,13.92 45.92,15.92 46.92,17.92 46.92,61.92 45.92,63.92 46.92,65.92 45.92,67.92 46.92,69.92 45.92,71.92 45.92,79.92 46.92,81.92 45.92,83.92 46.92,85.92 45.92,87.92 48.92,9.92 47.92,11.92 48.92,13.92 47.92,15.92 48.92,17.92 47.92,19.92 48.92,21.92 47.92,63.92 48.92,65.92 47.92,67.92 48.92,69.92 47.92,71.92 47.92,79.92 48.92,81.92 47.92,83.92 48.92,85.92 47.92,87.92 50.92,9.92 49.92,11.92 50.92,13.92 49.92,15.92 50.92,17.92 49.92,19.92 50.92,45.92 49.92,63.92 50.92,65.92 49.92,67.92 50.92,69.92 49.92,71.92 49.92,79.92 50.92,81.92 49.92,83.92 50.92,85.92 49.92,87.92 52.92,9.92 51.92,11.92 52.92,13.92 51.92,15.92 52.92,17.92 52.92,45.92 51.92,67.92 52.92,69.92 51.92,71.92 52.92,73.92 51.92,79.92 52.92,81.92 51.92,83.92 51.92,87.92 54.92,9.92 53.92,11.92 54.92,13.92 53.92,15.92 54.92,17.92 54.92,45.92 53.92,67.92 54.92,69.92 53.92,71.92 53.92,79.92 54.92,81.92 56.92,9.92 55.92,11.92 56.92,13.92 55.92,15.92 56.92,17.92 55.92,35.92 55.92,39.92 56.92,45.92 56.92,69.92 55.92,71.92 55.92,79.92 58.92,9.92 57.92,11.92 57.92,15.92 57.92,31.92 58.92,33.92 57.92,35.92 57.92,39.92 58.92,41.92 57.92,43.92 58.92,45.92 58.92,69.92 57.92,71.92 57.92,79.92 60.92,9.92 59.92,11.92 59.92,31.92 60.92,41.92 59.92,43.92 60.92,45.92 60.92,61.92 59.92,67.92 60.92,69.92 59.92,79.92 60.92,81.92 62.92,9.92 61.92,11.92 62.92,13.92 61.92,15.92 62.92,17.92 61.92,31.92 61.92,35.92 62.92,37.92 61.92,43.92 62.92,45.92 62.92,69.92 61.92,79.92 62.92,81.92 61.92,83.92 62.92,85.92 61.92,87.92 64.92,9.92 63.92,11.92 64.92,13.92 63.92,15.92 64.92,17.92 63.92,35.92 63.92,43.92 63.92,79.92 64.92,81.92 63.92,83.92 64.92,85.92 63.92,87.92 66.92,9.92 65.92,11.92 66.92,13.92 65.92,15.92 66.92,17.92 65.92,79.92 66.92,81.92 65.92,83.92 66.92,85.92 65.92,87.92 68.92,9.92 67.92,11.92 67.92,15.92 68.92,33.92 67.92,43.92 68.92,45.92 67.92,79.92 68.92,81.92 67.92,83.92 68.92,85.92 67.92,87.92 70.92,9.92 69.92,11.92 70.92,37.92 69.92,39.92 69.92,43.92 70.92,45.92 69.92,79.92 70.92,81.92 69.92,83.92 69.92,87.92 72.92,9.92 71.92,11.92 72.92,13.92 71.92,15.92 72.92,17.92 71.92,35.92 71.92,39.92 71.92,43.92 71.92,79.92 72.92,81.92 74.92,9.92 73.92,11.92 74.92,13.92 73.92,15.92 74.92,17.92 74.92,73.92 73.92,75.92 74.92,77.92 73.92,79.92 76.92,5.92 76.92,9.92 75.92,11.92 76.92,13.92 75.92,15.92 76.92,17.92 75.92,31.92 76.92,33.92 75.92,35.92 76.92,41.92 75.92,43.92 76.92,45.92 76.92,73.92 75.92,75.92 76.92,77.92 75.92,79.92 78.92,1.92 77.92,3.92 78.92,5.92 77.92,7.92 78.92,9.92 77.92,11.92 78.92,13.92 77.92,15.92 78.92,17.92 77.92,19.92 78.92,29.92 77.92,31.92 78.92,37.92 77.92,39.92 78.92,41.92 77.92,43.92 78.92,45.92 78.92,73.92 77.92,75.92 78.92,77.92 77.92,79.92 78.92,81.92 80.92,1.92 79.92,3.92 80.92,5.92 79.92,7.92 80.92,9.92 79.92,11.92 80.92,13.92 79.92,15.92 80.92,17.92 80.92,29.92 79.92,31.92 80.92,37.92 79.92,39.92 80.92,41.92 79.92,43.92 80.92,45.92 79.92,47.92 80.92,49.92 80.92,69.92 79.92,71.92 80.92,73.92 79.92,75.92 80.92,77.92 79.92,79.92 80.92,81.92 79.92,83.92 80.92,85.92 79.92,87.92 82.92,1.92 81.92,3.92 82.92,5.92 81.92,7.92 82.92,9.92 81.92,11.92 82.92,13.92 81.92,15.92 82.92,17.92 82.92,21.92 82.92,33.92 81.92,35.92 82.92,37.92 81.92,39.92 82.92,41.92 81.92,43.92 82.92,45.92 81.92,47.92 82.92,49.92 82.92,69.92 81.92,71.92 82.92,73.92 81.92,75.92 82.92,77.92 81.92,79.92 82.92,81.92 81.92,83.92 82.92,85.92 81.92,87.92 84.92,1.92 83.92,3.92 84.92,5.92 83.92,7.92 84.92,9.92 83.92,11.92 84.92,13.92 83.92,15.92 84.92,17.92 83.92,19.92 83.92,35.92 83.92,39.92 83.92,43.92 83.92,47.92 83.92,51.92 83.92,55.92 83.92,59.92 83.92,63.92 83.92,67.92 83.92,71.92 84.92,73.92 83.92,75.92 84.92,77.92 83.92,79.92 84.92,81.92 83.92,83.92 84.92,85.92 83.92,87.92 86.92,1.92 85.92,3.92 85.92,7.92 86.92,9.92 85.92,11.92 86.92,13.92 85.92,15.92 86.92,17.92 85.92,71.92 86.92,73.92 85.92,75.92 86.92,77.92 85.92,79.92 86.92,81.92 85.92,83.92 85.92,87.92 88.92,9.92 87.92,11.92 88.92,13.92 87.92,15.92 88.92,17.92 87.92,71.92 88.92,73.92 87.92,75.92 88.92,77.92 87.92,79.92 90.92,9.92 89.92,11.92 90.92,13.92 89.92,15.92 90.92,17.92 89.92,19.92 90.92,21.92 89.92,23.92 90.92,25.92 89.92,27.92 90.92,29.92 89.92,31.92 90.92,33.92 89.92,35.92 90.92,37.92 89.92,39.92 90.92,41.92 89.92,43.92 90.92,45.92 89.92,47.92 90.92,49.92 89.92,51.92 90.92,53.92 89.92,55.92 90.92,57.92 89.92,59.92 90.92,61.92 89.92,63.92 90.92,65.92 89.92,67.92 90.92,69.92 89.92,71.92 90.92,73.92 89.92,75.92 90.92,77.92 89.92,79.92 92.92,9.92 91.92,11.92 92.92,13.92 91.92,15.92 92.92,17.92 91.92,19.92 92.92,21.92 91.92,23.92 92.92,25.92 91.92,27.92 92.92,29.92 91.92,31.92 92.92,33.92 91.92,35.92 92.92,37.92 91.92,39.92 92.92,41.92 91.92,43.92 92.92,45.92 91.92,47.92 92.92,49.92 91.92,51.92 92.92,53.92 91.92,55.92 92.92,57.92 91.92,59.92 92.92,61.92 91.92,63.92 92.92,65.92 91.92,67.92 92.92,69.92 91.92,71.92 92.92,73.92 91.92,75.92 92.92,77.92 91.92,79.92 93.92,7.92 93.92,11.92 93.92,15.92 93.92,19.92 93.92,23.92 93.92,27.92 93.92,31.92 93.92,35.92 93.92,39.92 93.92,43.92 93.92,47.92 93.92,51.92 93.92,55.92 93.92,59.92 93.92,63.92 93.92,67.92 93.92,71.92 93.92,75.92 93.92,79.92
  pour Top (isolate 0.61, rank 6): 0,0 0,90.81 93.98,90.81 95.89,90.81 95.89,0
  pour Bottom (isolate 0.61, rank 6): 0,0 0,90.81 93.98,90.81 95.89,90.81 95.89,0
GPIO15
  Top 0.305: JP2.37 82.44,23.5 R1.1 R2.2
N$1  (1 unrouted)
N$2  (1 unrouted)
N$3  (1 unrouted)
N$4  (1 unrouted)
N$6  (1 unrouted)
N$7  (1 unrouted)

### Text on the board
tPlace: JLCJLCJLC
bPlace: 4 | 2 | 1 | 3 | SRAD BAT | EMATCH2 | EMATCH1 | EMATCH2 EXT PWR | EMATCH1 EXT PWR | CAN1 | CAN0 | SAFETY / KEYSWITCH | POWER / KEYSWITCH | BAT2 OUT | BAT2 IN | BAT1 OUT | BAT1 IN
tNames: REV C | CON